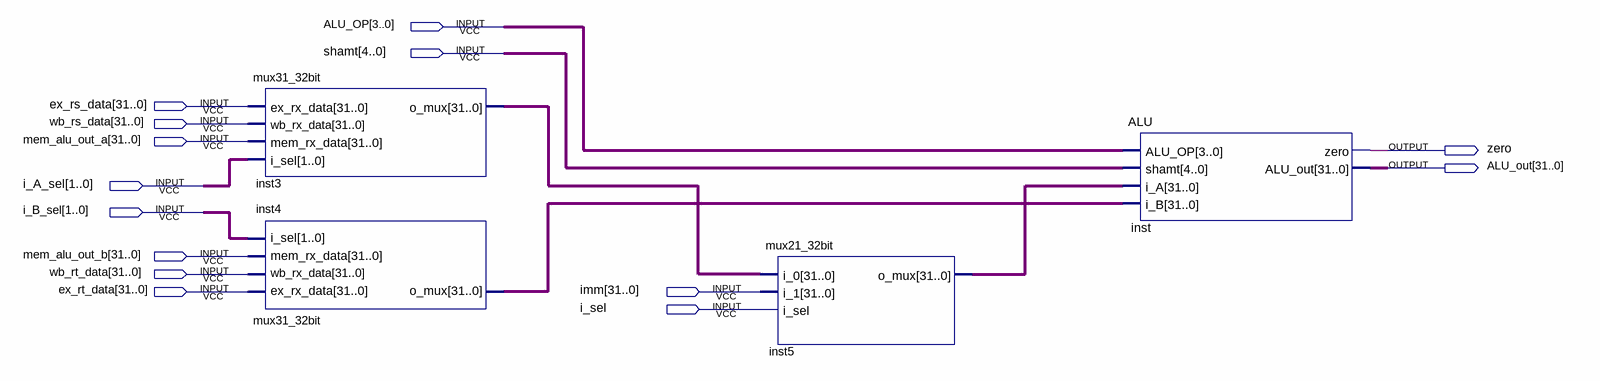
[diagram p0: schematic sheet]
// Quartus schematic FU_ALU.bdf as structural Verilog: 4 symbols, 14 pins
module FU_ALU (
  input  [3:0] ALU_OP,
  input  [4:0] shamt,
  input  [31:0] ex_rs_data,
  input  [31:0] wb_rs_data,
  input  [31:0] mem_alu_out_a,
  input  [1:0] i_A_sel,
  input  [1:0] i_B_sel,
  input  [31:0] mem_alu_out_b,
  input  [31:0] wb_rt_data,
  input  [31:0] ex_rt_data,
  input  [31:0] imm,
  input  i_sel,
  output zero,
  output [31:0] ALU_out
);

  wire [31:0] inst3_o_mux, inst4_o_mux, inst5_o_mux;

  mux31_32bit inst3 (
    .ex_rx_data(ex_rs_data), .wb_rx_data(wb_rs_data), .mem_rx_data(mem_alu_out_a), .i_sel(i_A_sel),
    .o_mux(inst3_o_mux));
  mux31_32bit inst4 (
    .ex_rx_data(ex_rt_data), .wb_rx_data(wb_rt_data), .mem_rx_data(mem_alu_out_b), .i_sel(i_B_sel),
    .o_mux(inst4_o_mux));
  mux21_32bit inst5 (.i_0(inst3_o_mux), .i_1(imm), .i_sel(i_sel), .o_mux(inst5_o_mux));
  ALU inst (.ALU_OP(ALU_OP), .shamt(shamt), .i_A(inst5_o_mux), .i_B(inst4_o_mux), .zero(zero), .ALU_out(ALU_out));
endmodule
